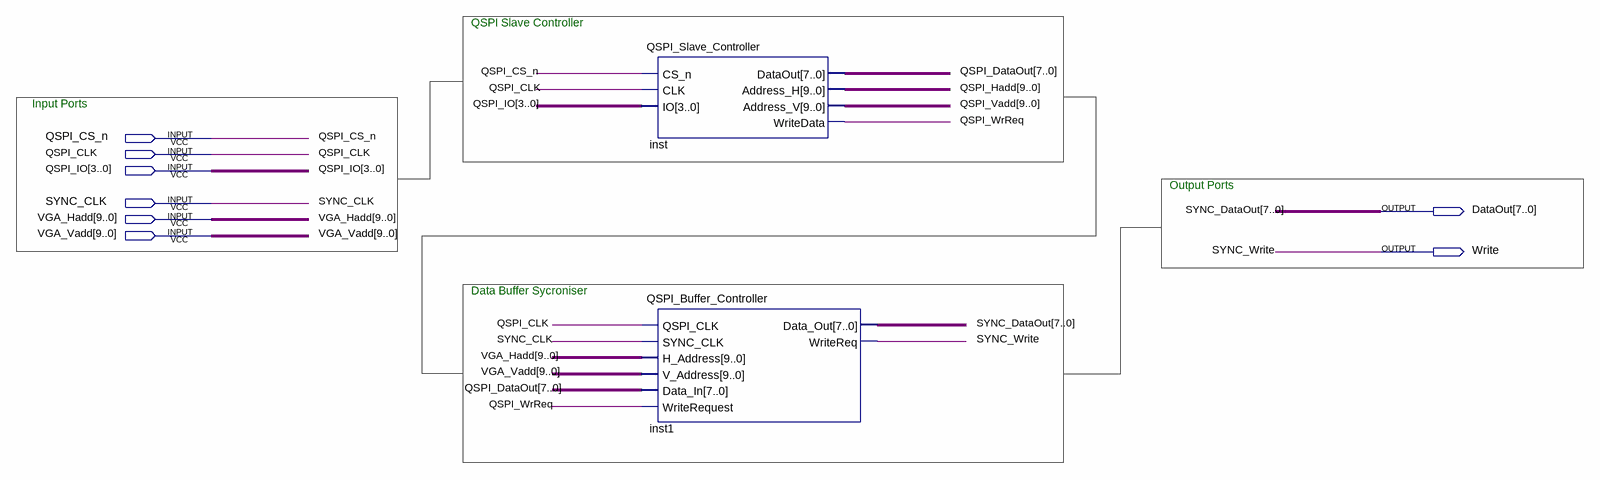
[diagram p0: schematic sheet]
// Quartus schematic QSPI_Slave.bdf as structural Verilog: 2 symbols, 8 pins
module QSPI_Slave (
  input  QSPI_CS_n,
  input  QSPI_CLK,
  input  [3:0] QSPI_IO,
  input  SYNC_CLK,
  input  [9:0] VGA_Hadd,
  input  [9:0] VGA_Vadd,
  output [7:0] DataOut,
  output Write
);

  wire QSPI_WrReq;
  wire [7:0] QSPI_DataOut;
  wire [9:0] QSPI_Hadd, QSPI_Vadd;

  QSPI_Slave_Controller inst (
    .CS_n(QSPI_CS_n), .CLK(QSPI_CLK), .IO(QSPI_IO), .DataOut(QSPI_DataOut), .Address_H(QSPI_Hadd),
    .Address_V(QSPI_Vadd), .WriteData(QSPI_WrReq));
  QSPI_Buffer_Controller inst1 (
    .QSPI_CLK(QSPI_CLK), .SYNC_CLK(SYNC_CLK), .H_Address(VGA_Hadd), .V_Address(VGA_Vadd),
    .Data_In(QSPI_DataOut), .WriteRequest(QSPI_WrReq), .Data_Out(DataOut), .WriteReq(Write));

  // Other names for the same wires on the sheet: SYNC_DataOut[7:0] = DataOut; SYNC_Write = Write

  // Notes on the sheet:
  //   QSPI Slave Controller
  //   Input Ports
  //   Output Ports
  //   Data Buffer Sycroniser
endmodule
